# EAGLE design arduinoDcc1.3 (EAGLE 6.6.0)
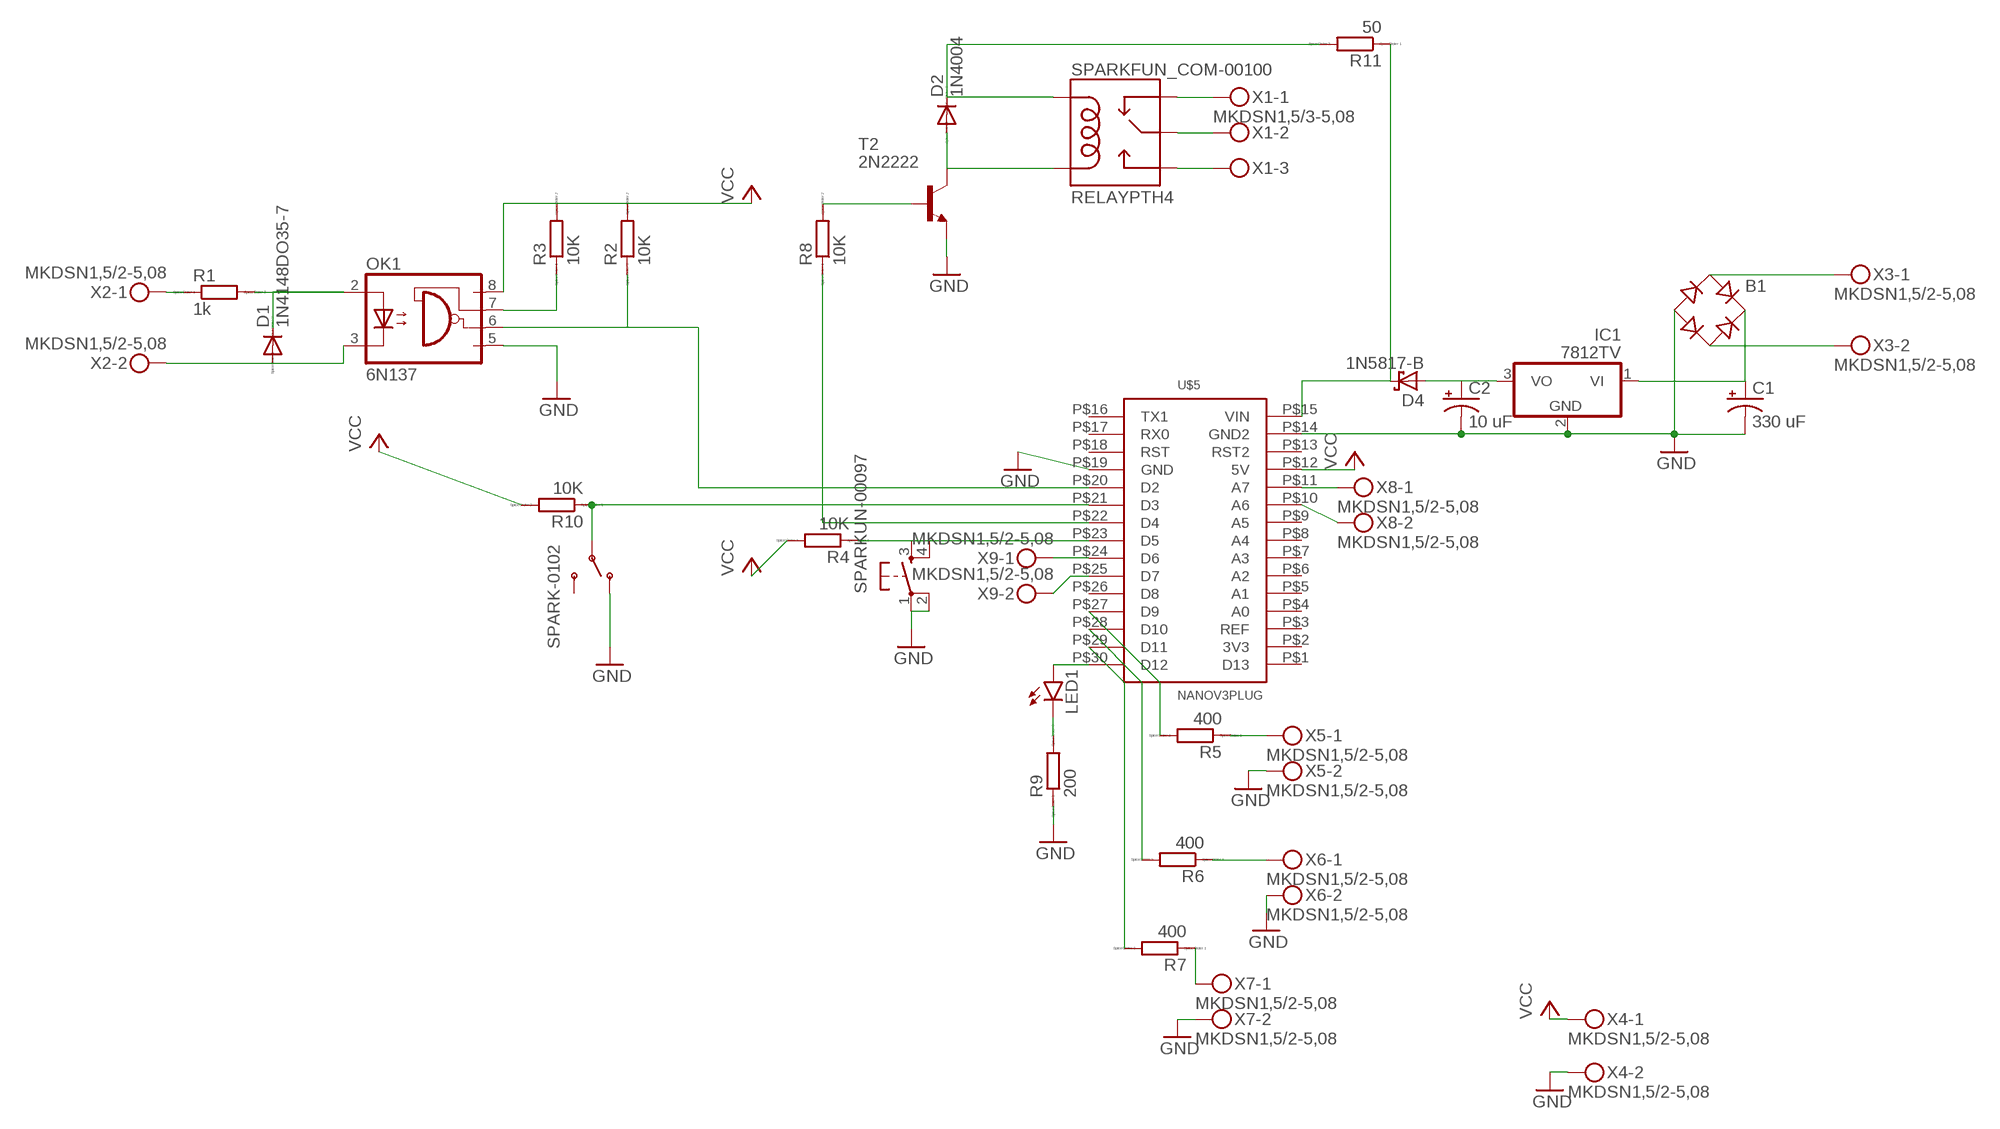
[diagram p0: schematic, sheet 1]

## Parts
B1  RB1A  [RB1A]
C1  330 uF  CAP_POLPTH1  [CPOL-RADIAL-100UF-25V]
C2  10 uF  CAP_POLPTH1  [CPOL-RADIAL-100UF-25V]
D1  1N4148DO35-7  [DO35-7]
D2  1N4004  [DO41-10]
D4  1N5817-B  [DO41-7.6]
IC1  7812TV  [TO220V]
LED1  LED3MM  [LED3MM]
OK1  6N137  [DIL08]
R1  1k  R0207/10  [0207/10]
R2  10K  R0207/10  [0207/10]
R3  10K  R0207/10  [0207/10]
R4  10K  R0207/10  [0207/10]
R5  400  R0207/10  [0207/10]
R6  400  R0207/10  [0207/10]
R7  400  R0207/10  [0207/10]
R8  10K  R0207/10  [0207/10]
R9  200  R0204/7  [0204/7]
R10  10K  R0207/10  [0207/10]
R11  50  R0207/10  [0207/10]
SPARK-0102  SWITCH-SPDTPTH  [SWITCH-SPDT]
SPARKFUN_COM-00100  RELAYPTH4  [RELAY-JZC]
SPARKUN-00097  TAC_SWITCHPTH  [TACTILE-PTH]
T2  2N2222  [TO18]
U$5  NANOV3PLUG  [HEADER15-2]
X1  MKDSN1,5/3-5,08  [MKDSN1,5/3-5,08]
X2  MKDSN1,5/2-5,08  [MKDSN1,5/2-5,08]
X3  MKDSN1,5/2-5,08  [MKDSN1,5/2-5,08]
X4  MKDSN1,5/2-5,08  [MKDSN1,5/2-5,08]
X5  MKDSN1,5/2-5,08  [MKDSN1,5/2-5,08]
X6  MKDSN1,5/2-5,08  [MKDSN1,5/2-5,08]
X7  MKDSN1,5/2-5,08  [MKDSN1,5/2-5,08]
X8  MKDSN1,5/2-5,08  [MKDSN1,5/2-5,08]
X9  MKDSN1,5/2-5,08  [MKDSN1,5/2-5,08]

## Nets
GND: B1.- C1.2(-) C2.2(-) IC1.2(GND) OK1.5(GND) R9.1 SPARK-0102.1(O) SPARKUN-00097.1 SPARKUN-00097.2 T2.1(E) U$5.P$14(GND2) U$5.P$19(GND) X4.2 X5.2 X6.2 X7.2
N$1: R1.1 X2.1
N$2: D1.C OK1.2(A) R1.2
N$3: D1.A OK1.3(C) X2.2
N$4: R10.1 SPARK-0102.2(P) U$5.P$21(D3)
N$5: D2.A SPARKFUN_COM-00100.1(COIL2) T2.3(C)
N$6: OK1.6(VO) R2.1 U$5.P$20(D2)
N$7: OK1.7(VE) R3.1
N$8: B1.AC1 X3.1
N$9: SPARKFUN_COM-00100.2(NC) X1.1
N$10: SPARKFUN_COM-00100.4(MAIN) X1.2
N$11: SPARKFUN_COM-00100.3(NO) X1.3
N$12: R8.1 U$5.P$22(D4)
N$13: R6.1 X6.1
N$14: R7.2 U$5.P$29(D11)
N$15: R6.2 U$5.P$28(D10)
N$16: R5.2 U$5.P$27(D9)
N$17: R5.1 X5.1
N$18: R4.1 SPARKUN-00097.3 SPARKUN-00097.4 U$5.P$23(D5)
N$19: U$5.P$24(D6) X9.1
N$20: U$5.P$25(D7) X9.2
N$21: U$5.P$11(A7) X8.1
N$22: U$5.P$10(A6) X8.2
N$23: B1.AC2 X3.2
N$24: B1.+ C1.1(+) IC1.1(VI)
N$25: LED1.K(C) R9.2
N$26: LED1.A U$5.P$30(D12)
N$27: R7.1 X7.1
N$28: C2.1(+) D4.A IC1.3(VO)
N$29: R8.2 T2.2(B)
N$30: D2.C R11.2 SPARKFUN_COM-00100.5(COIL1)
N$31: D4.C R11.1 U$5.P$15(VIN)
VCC: OK1.8(VCC) R2.2 R3.2 R4.2 R10.2 U$5.P$12(5V) X4.1
Unconnected: SPARK-0102.3(S) U$5.P$1(D13) U$5.P$2(3V3) U$5.P$3(REF) U$5.P$4(A0) U$5.P$5(A1) U$5.P$6(A2) U$5.P$7(A3) U$5.P$8(A4) U$5.P$9(A5) U$5.P$13(RST2) U$5.P$16(TX1) U$5.P$17(RX0) U$5.P$18(RST) U$5.P$26(D8)

## Library data of the parts
B1 = rectifier:RB1A: RECTIFIER 1 A
C1 C2 = SparkFun-Capacitors:CAP_POL: Capacitor Polarized These are standard SMD and PTH capacitors. Normally 10uF, 47uF, and 100uF in electrolytic and tantalum varieties. Always verify the external diameter of the through hole cap, it varies with capacity, voltage, and manufacturer. The EIA devices should be standard.
D1 = diode:1N4148: DIODE high speed (Philips)
D2 = diode:1N4004: DIODE general purpose rectifier, 1 A
D4 = diode:1N581*: 1.0A SCHOTTKY BARRIER RECTIFIER Source: http://www.diodes.com/datasheets/ds23001.pdf
IC1 = linear:78*: Positive VOLTAGE REGULATOR Source: http://cache.national.com/ds/LM/LM78L05.pdf http://www.fairchildsemi.com/ds/LM/LM7805.pdf
LED1 = SparkFun-LED:LED: LEDs Standard schematic elements and footprints for 5mm, 3mm, 1206, and 0603 sized LEDs. 5mm - Spark Fun Electronics SKU : COM-00529 (and others)
OK1 = optocoupler:6N137: MOTOROLA OPTO COUPLER; MPN: 6N137; OC_FARNELL: 1328376; OC_NEWARK: 52M1895
R1-R11 = eagle-ltspice:R: RESISTOR, European symbol; SPICEMODEL: NONE; SPICEPREFIX: R
SPARK-0102 = SparkFun-Electromechanical:SWITCH-SPDT: SPDT Switch Simple slide switch, Spark Fun Electronics SKU : COM-00102 DPDT SMT slide switch, AYZ0202, SWCH-08179
SPARKFUN_COM-00100 = SparkFun-Electromechanical:RELAY: SPDT relay (COM-00101)
SPARKUN-00097 = SparkFun-Electromechanical:TAC_SWITCH: Momentary Switch Button commonly used for reset or general input. Spark Fun Electronics SKU : COM-00097 SMT- SWCH-08247
T2 = transistor:2N2222: NPN TRANSISTOR
U$5 = ArduinoNanoPlug:NANOV3PLUG
X1 = con-phoenix-508:MKDSN1,5/3-5,08: MKDSN 1,5/ 3-5,08 Printklemme Nennstrom: 13,5 A Nennspannung: 250 V Rastermaß: 5,08 mm Polzahl: 3 Anschlussart: Schraubanschluss Montage: Löten Anschlussrichtung Leiter/Platine: 0 ° Artikelnummer: 1729131 Source: http://eshop.phoenixcontact.com .. 1729131.pdf
X2-X9 = con-phoenix-508:MKDSN1,5/2-5,08: MKDSN 1,5/ 2-5,08 Printklemme Nennstrom: 13,5 A Nennspannung: 250 V Rastermaß: 5,08 mm Polzahl: 2 Anschlussart: Schraubanschluss Montage: Löten Anschlussrichtung Leiter/Platine: 0 ° Artikelnummer: 1729128 Source: http://eshop.phoenixcontact.com .. 1729128.pdf

## Board
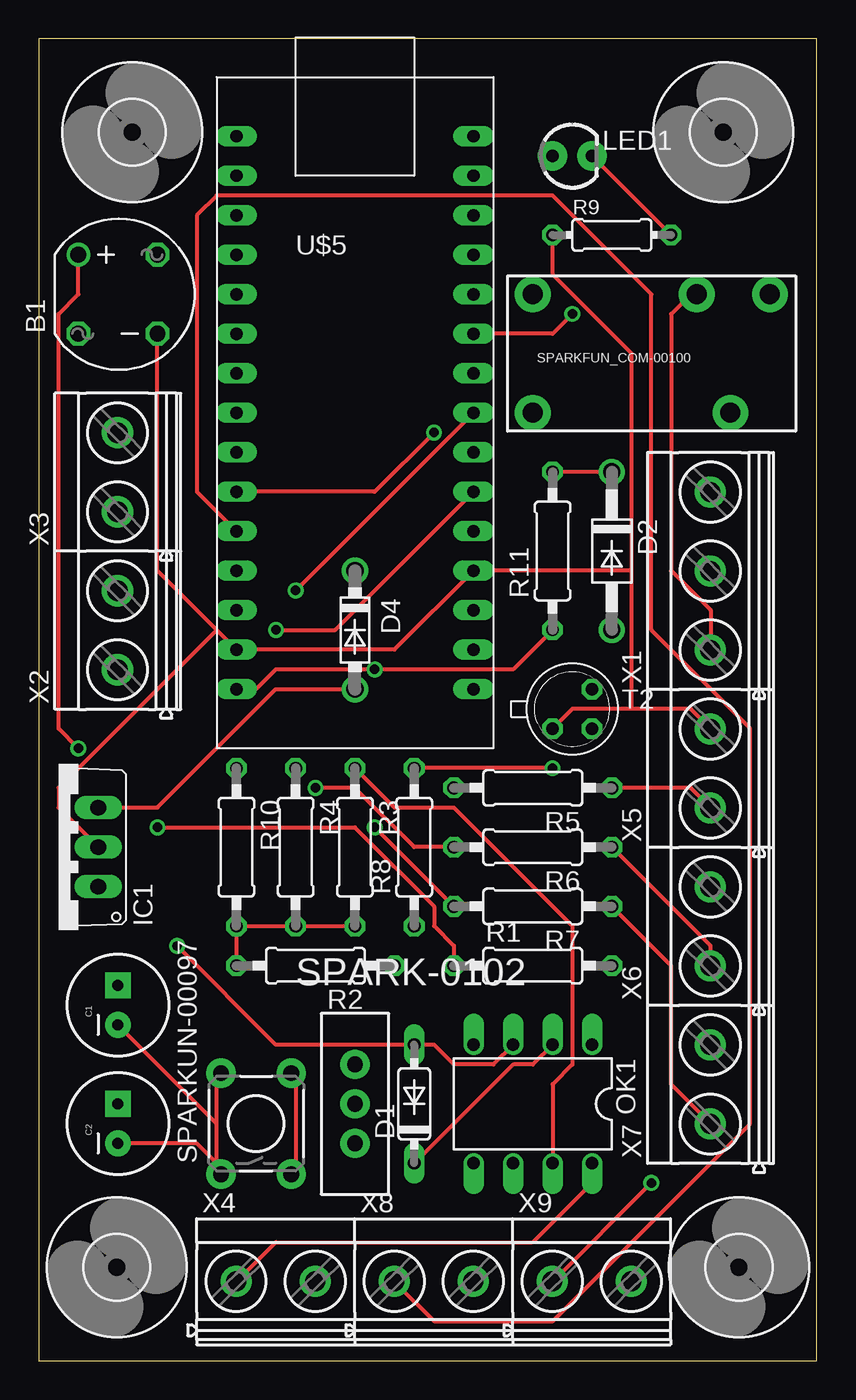
[diagram p1: board, top side]
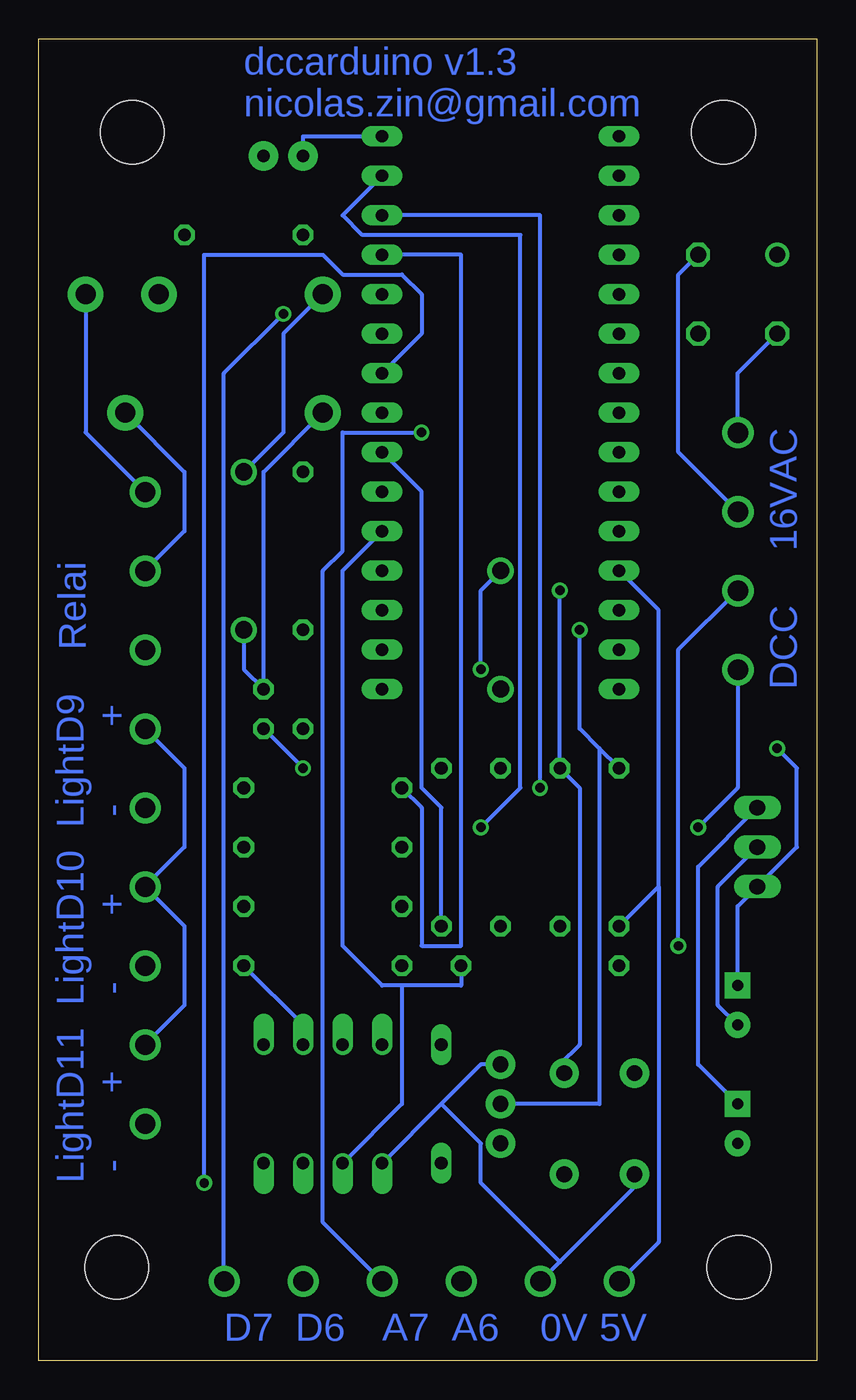
[diagram p2: board, bottom side, seen from below]

Size 50 x 85 mm. Coordinates in mm from the lower left corner, seen from the top.
Outline: 0,0 50,0 50,85 0,85 0,0
Copper layers (1*16): Top 0.035mm / dielectric 1.5mm / Bottom 0.035mm
Design rules "default": minimum track width 10mil, minimum drill 24mil, track to track 8mil, track to pad 8mil, pad to pad 8mil, via to via 8mil, smd to smd 8mil, copper to edge 40mil, drill to drill 8mil, minimum pad ring 10mil, minimum via ring 8mil, stop-mask expansion 4mil, vias tented up to drill 0mil, thermal gap 10mil

### Footprints (pad centres in the part's own frame; a part is rotated, then mirrored left to right if it is on the bottom)
RB1A = drill 1.016: + -2.54,2.54 | drill 1.016 octagon: - 2.54,-2.54; AC1 2.54,2.54; AC2 -2.54,-2.54
CPOL-RADIAL-100UF-25V = drill 0.7 pad 1.651 square: 1 1.27,0 | drill 0.7 pad 1.651: 2 -1.27,0
DO35-7 = drill 0.813 long: A 3.81,0; C -3.81,0
DO41-10 = drill 1.118: A 5.08,0; C -5.08,0
DO41-7.6 = drill 1.1 pad 1.7: A 3.81,0; C -3.81,0
TO220V = drill 1.016 long: 1 -2.54,-2.54; 2 0,-2.54; 3 2.54,-2.54
LED3MM = drill 0.813 pad 1.88: A -1.27,0; K 1.27,0
DIL08 = drill 0.813 offset: 1 -3.81,-3.81; 2 -1.27,-3.81; 3 1.27,-3.81; 4 3.81,-3.81; 5 3.81,3.81; 6 1.27,3.81; 7 -1.27,3.81; 8 -3.81,3.81
0207/10 = drill 0.813 octagon: 1 -5.08,0; 2 5.08,0
0204/7 = drill 0.813 octagon: 1 -3.81,0; 2 3.81,0
SWITCH-SPDT = drill 1.016 pad 1.88: 1 0,2.54; 2 0,0; 3 0,-2.54
RELAY-JZC = drill 1.3 pad 2.286: 1 3.81,-8.89; 2 -3.81,1.651; 3 -3.81,6.35; 4 3.81,3.81; 5 -3.81,-8.89
TACTILE-PTH = drill 1.016 pad 1.88: 1 -3.251,2.261; 2 3.251,2.261; 3 -3.251,-2.261; 4 3.251,-2.261
TO18 = drill 0.813 octagon: 1 -1.27,-1.27; 2 1.27,-1.27; 3 1.27,1.27
4,1 = hole 4.1: 0,0
HEADER15-2 = drill 0.8 long: P$1 -7.62,17.78; P$2 -7.62,15.24; P$3 -7.62,12.7; P$4 -7.62,10.16; P$5 -7.62,7.62; P$6 -7.62,5.08; P$7 -7.62,2.54; P$8 -7.62,0; P$9 -7.62,-2.54; P$10 -7.62,-5.08; P$11 -7.62,-7.62; P$12 -7.62,-10.16; P$13 -7.62,-12.7; P$14 -7.62,-15.24; P$15 -7.62,-17.78; P$16 7.62,-17.78; P$17 7.62,-15.24; P$18 7.62,-12.7; P$19 7.62,-10.16; P$20 7.62,-7.62; P$21 7.62,-5.08; P$22 7.62,-2.54; P$23 7.62,0; P$24 7.62,2.54; P$25 7.62,5.08; P$26 7.62,7.62; P$27 7.62,10.16; P$28 7.62,12.7; P$29 7.62,15.24; P$30 7.62,17.78
MKDSN1,5/3-5,08 = drill 1.3 pad 2: 1 -7.641,0.025; 2 -2.561,0.025; 3 2.519,0.025
MKDSN1,5/2-5,08 = drill 1.3 pad 2: 1 -2.561,0.025; 2 2.519,0.025

### Placement (x,y rotation side)
B1  5.08,68.58 0 top
C1  5.08,22.86 90 top
C2  5.08,15.24 90 top
D1  24.13,16.51 90 top
D2  36.83,52.07 270 top
D4  20.32,46.99 270 top
IC1  1.27,33.02 90 top
LED1  34.29,77.47 0 top
OK1  31.75,16.51 180 top
R1  31.75,25.4 0 top
R2  17.78,25.4 180 top
R3  20.32,33.02 270 top
R4  16.51,33.02 270 top
R5  200  [0207/10]  31.75,36.83 180 top
R6  200  [0207/10]  31.75,33.02 180 top
R7  200  [0207/10]  31.75,29.21 180 top
R8  24.13,33.02 90 top
R9  36.83,72.39 0 top
R10  12.7,33.02 270 top
R11  33.02,52.07 90 top
SPARK-0102  20.32,16.51 0 top
SPARKFUN_COM-00100  40.64,64.77 270 top
SPARKUN-00097  13.97,15.24 90 top
T2  34.29,41.91 0 top
U$1  [4,1]  5,6 0 top
U$2  [4,1]  6,79 0 top
U$3  [4,1]  45,6 0 top
U$4  [4,1]  44,79 0 top
U$5  20.32,60.96 0 top
X1  43.18,53.34 90 top
X2  5.08,46.99 90 top
X3  5.08,57.15 90 top
X4  15.24,5.08 0 top
X5  43.18,38.1 90 top
X6  43.18,27.94 90 top
X7  43.18,17.78 90 top
X8  25.4,5.08 0 top
X9  35.56,5.08 0 top

### Tracks (layer width: path | path; a pad name or v marks a point on that pad's centre or on a via)
GND
  Top 0.254: C2.2 10.16,13.97 11.43,12.7 | 11.43,12.7 11.43,15.24 | 11.43,15.24 11.43,17.78 SPARKUN-00097.2 | 11.43,12.7 SPARKUN-00097.1 | 11.43,15.24 C1.2 | B1.- 7.62,50.8 11.43,46.99 | 11.43,46.99 U$5.P$14 22.86,45.72 U$5.P$19 38.1,50.8 | T2.1 34.29,41.91 38.1,41.91 | 38.1,41.91 41.91,41.91 43.18,40.64 X5.2 | R9.1 33.02,69.85 38.1,64.77 38.1,50.8 | 38.1,41.91 38.1,50.8 | IC1.2 1.27,35.56 1.27,36.83 11.43,46.99
  Bottom 0.254: 24.13,16.51 21.59,19.05 SPARK-0102.1 | 24.13,16.51 OK1.5 | IC1.2 6.35,30.48 6.35,22.86 C1.2 | 16.51,6.35 11.43,11.43 SPARKUN-00097.1 | 16.51,6.35 17.78,5.08 X4.2 | 24.13,16.51 21.59,13.97 21.59,11.43 16.51,6.35 | 43.18,30.48 40.64,27.94 40.64,22.86 43.18,20.32 X7.2 | 43.18,30.48 40.64,33.02 40.64,38.1 43.18,40.64 X5.2 | 43.18,30.48 X6.2
N$1  (via drill 0.61)
  Top 0.254: R1.1 26.67,26.67 25.4,27.94 25.4,29.21 20.32,34.29 v7.62,34.29
  Bottom 0.254: v7.62,34.29 5.08,36.83 5.08,44.45 X2.1
N$2
  Top 0.254: D1.C 30.48,19.05 31.75,19.05 OK1.2
  Bottom 0.254: R1.2 33.02,21.59 OK1.2
N$3  (via drill 0.61)
  Top 0.254: OK1.3 29.21,19.05 26.67,19.05 25.4,20.32 D1.A 15.24,20.32 v8.89,26.67
  Bottom 0.254: v8.89,26.67 8.89,45.72 5.08,49.53 X2.2
N$4  (via drill 0.61)
  Top 0.254: U$5.P$21 19.05,46.99 v15.24,46.99
  Bottom 0.254: v15.24,46.99 15.24,40.64 13.97,39.37 | R10.1 13.97,39.37 | SPARK-0102.2 13.97,16.51 13.97,39.37
N$5
  Bottom 0.254: D2.A 36.83,44.45 T2.3 35.56,57.15 SPARKFUN_COM-00100.1
N$6
  Bottom 0.254: U$5.P$20 30.48,50.8 30.48,26.67 27.94,24.13 26.67,24.13 | 26.67,24.13 22.86,24.13 R2.1 | OK1.6 26.67,16.51 26.67,24.13
N$7
  Top 0.254: OK1.7 33.02,17.78 34.29,19.05 34.29,27.94 26.67,35.56 22.86,35.56 R3.1
N$8
  Bottom 0.254: B1.AC1 8.89,69.85 8.89,58.42 5.08,54.61 X3.1
N$9
  Top 0.254: X1.1 43.18,45.72 43.18,48.26 40.64,50.8 40.64,67.31 41.91,68.58 SPARKFUN_COM-00100.2
N$10
  Bottom 0.254: SPARKFUN_COM-00100.4 40.64,57.15 40.64,53.34 43.18,50.8 X1.2
N$11
  Bottom 0.254: SPARKFUN_COM-00100.3 46.99,59.69 43.18,55.88 X1.3
N$12
  Bottom 0.254: U$5.P$22 25.4,55.88 25.4,36.83 24.13,35.56 R8.1
N$13
  Top 0.254: R6.1 43.18,26.67 43.18,25.4 X6.1
N$14  (via drill 0.61)
  Top 0.254: R7.2 v21.59,34.29
  Bottom 0.254: U$5.P$29 30.48,73.66 29.21,72.39 19.05,72.39 19.05,36.83 v21.59,34.29
N$15  (via drill 0.61)
  Top 0.254: v17.78,36.83 20.32,36.83 24.13,33.02 R6.2
  Bottom 0.254: U$5.P$28 17.78,73.66 v17.78,36.83
N$16
  Bottom 0.254: U$5.P$27 22.86,71.12 22.86,26.67 25.4,26.67 25.4,35.56 R5.2
N$17
  Top 0.254: R5.1 41.91,36.83 43.18,35.56 X5.1
N$18  (via drill 0.61)
  Top 0.254: SPARKUN-00097.3 16.51,12.7 16.51,17.78 SPARKUN-00097.4 | v16.51,49.53 U$5.P$23
  Bottom 0.254: v16.51,49.53 R4.1 15.24,36.83 15.24,20.32 16.51,19.05 SPARKUN-00097.4
N$19  (via drill 0.61)
  Top 0.254: v39.37,11.43 33.02,5.08 X9.1
  Bottom 0.254: U$5.P$24 25.4,66.04 25.4,68.58 26.67,69.85 30.48,69.85 31.75,71.12 39.37,71.12 v39.37,11.43
N$20  (via drill 0.61)
  Top 0.254: U$5.P$25 33.02,66.04 v34.29,67.31
  Bottom 0.254: v34.29,67.31 38.1,63.5 38.1,5.08 X9.2
N$21
  Top 0.254: U$5.P$11 10.16,55.88 10.16,73.66 11.43,74.93 33.02,74.93 39.37,68.58 39.37,46.99 45.72,40.64 45.72,15.24 33.02,2.54 25.4,2.54 22.86,5.08 X8.1
N$22  (via drill 0.61)
  Top 0.254: U$5.P$10 21.59,55.88 v25.4,59.69
  Bottom 0.254: v25.4,59.69 30.48,59.69 30.48,52.07 31.75,50.8 31.75,8.89 27.94,5.08 X8.2
N$23
  Bottom 0.254: B1.AC2 5.08,63.5 5.08,59.69 X3.2
N$24  (via drill 0.61)
  Top 0.254: B1.+ 2.54,68.58 1.27,67.31 1.27,40.64 v2.54,39.37
  Bottom 0.254: C1.1 5.08,29.21 IC1.1 1.27,33.02 1.27,38.1 v2.54,39.37
N$25
  Top 0.254: LED1.K R9.2
N$26
  Bottom 0.254: U$5.P$30 33.02,78.74 LED1.A
N$27
  Top 0.254: R7.1 40.64,25.4 40.64,17.78 43.18,15.24 X7.1
N$28
  Top 0.254: D4.A 15.24,43.18 7.62,35.56 IC1.3
  Bottom 0.254: IC1.3 7.62,31.75 7.62,19.05 C2.1
N$29  (via drill 0.61)
  Top 0.254: v33.02,38.1 R8.2
  Bottom 0.254: T2.2 v33.02,38.1
N$30
  Top 0.254: D2.C R11.2
  Bottom 0.254: D2.C 34.29,59.69 34.29,66.04 SPARKFUN_COM-00100.5
N$31  (via drill 0.61)
  Top 0.254: U$5.P$15 13.97,43.18 15.24,44.45 v21.59,44.45 30.48,44.45 R11.1
  Bottom 0.254: D4.C 21.59,49.53 v21.59,44.45
VCC
  Top 0.254: OK1.8 35.56,11.43 31.75,7.62 15.24,7.62 12.7,5.08 X4.1 | R2.2 R10.2 R4.2 R3.2
  Bottom 0.254: U$5.P$12 10.16,48.26 10.16,30.48 | R10.2 10.16,30.48 | 10.16,30.48 10.16,7.62 12.7,5.08 X4.1

### Text on the board
Bottom: dccarduino v1.3 / nicolas.zin@gmail.com | 16VAC | Relai | DCC | LightD9 / - + | LightD10 / - + | LightD11 / - + | 5V | 0V | A7 A6 | D7 D6